# EAGLE design ReliefBoard (EAGLE 9.6.2)
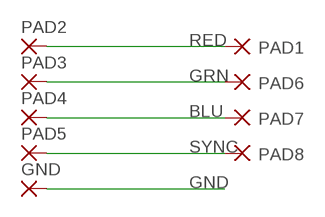
[diagram p0: schematic, sheet 1]

## Parts
GND  SMD2  [SMD1,27-2,54]
PAD1  SMD2  [SMD1,27-2,54]
PAD2  SMD2  [SMD1,27-2,54]
PAD3  SMD2  [SMD1,27-2,54]
PAD4  SMD2  [SMD1,27-2,54]
PAD5  SMD2  [SMD1,27-2,54]
PAD6  SMD2  [SMD1,27-2,54]
PAD7  SMD2  [SMD1,27-2,54]
PAD8  SMD2  [SMD1,27-2,54]

## Nets
BLU: PAD4.1(P) PAD7.1(P)
GND: GND.1(P)
GRN: PAD3.1(P) PAD6.1(P)
RED: PAD1.1(P) PAD2.1(P)
SYNC: PAD5.1(P) PAD8.1(P)

## Library data of the parts
GND PAD1-PAD8 = wirepad:SMD2: SMD PAD

## Board
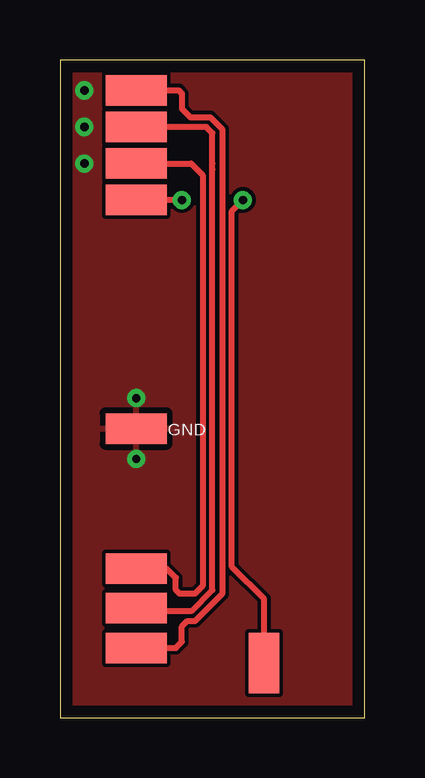
[diagram p1: board, top side]
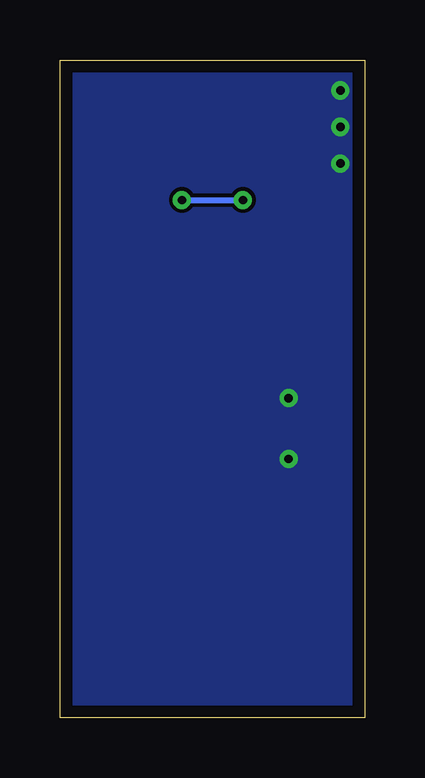
[diagram p2: board, bottom side, seen from below]

Size 12.7 x 27.43 mm. Coordinates in mm from the lower left corner, seen from the top.
Outline: 0,0 12.7,0 12.7,27.43 0,27.43 0,0
Copper layers (1*16): Top 0.035mm / dielectric 1.5mm / Bottom 0.035mm
Design rules "default *": minimum track width 6mil, minimum drill 0.35mm, track to track 6mil, track to pad 6mil, pad to pad 6mil, via to via 6mil, smd to smd 6mil, copper to edge 20mil, drill to drill 6mil, minimum pad ring 10mil, minimum via ring 8mil, stop-mask expansion 4mil, vias tented up to drill 20mil, thermal gap 10mil

### Footprints (pad centres in the part's own frame; a part is rotated, then mirrored left to right if it is on the bottom)
SMD1,27-2,54 = smd 1.27 x 2.54: 1 0,0

### Placement (x,y rotation side)
GND  3.17,12.06 90 top
PAD1  3.17,23.11 90 top
PAD2  3.17,6.22 270 top
PAD3  3.17,4.57 90 top
PAD4  3.17,2.92 90 top
PAD5  8.51,2.29 180 top
PAD6  3.17,24.64 90 top
PAD7  3.17,26.16 90 top
PAD8  3.17,21.59 270 top

### Tracks (layer width: path | path; a pad name or v marks a point on that pad's centre or on a via)
BLU
  Top 0.254: PAD7.1 4.95,26.16 5.08,26.04 5.08,25.4 5.44,25.04 6.26,25.04 6.76,24.55 6.76,5.17 5.63,4.04 5.31,4.04 5.08,3.81 5.08,3.17 4.83,2.92 PAD4.1
GND  (via drill 0.35)
  other vias: 1.02,26.16 1.02,24.64 1.02,23.11 3.17,13.34 3.17,10.79
  pour Top: -1.91,29.21 13.97,29.21 13.97,-1.91 -3.17,-1.91 -3.17,29.21
  pour Bottom: -1.91,28.57 -1.91,-1.91 15.24,-1.91 15.24,28.57
GRN
  Top 0.254: PAD3.1 3.3,4.45 5.46,4.45 6.35,5.33 6.35,22.86 6.35,23.11 6.35,24.38 6.1,24.64 PAD6.1
RED
  Top 0.254: PAD1.1 5.46,23.11 5.94,22.63 5.94,5.5 5.62,5.18 4.98,5.18 4.83,5.33 4.83,5.84 4.45,6.22 PAD2.1
SYNC  (via drill 0.35)
  Top 0.254: PAD5.1 8.51,4.95 7.16,6.3 7.16,21.13 v7.62,21.59 | v5.08,21.59 PAD8.1
  Bottom 0.254: v7.62,21.59 v5.08,21.59

### Text on the board
tDocu: B | G | R | SYNC | GenesisMD Model 1 / Relief Board | 27 | R | 28 | G | SYNC | 29 | B | 42